# EAGLE design rpi_vga (EAGLE 6.6.0)
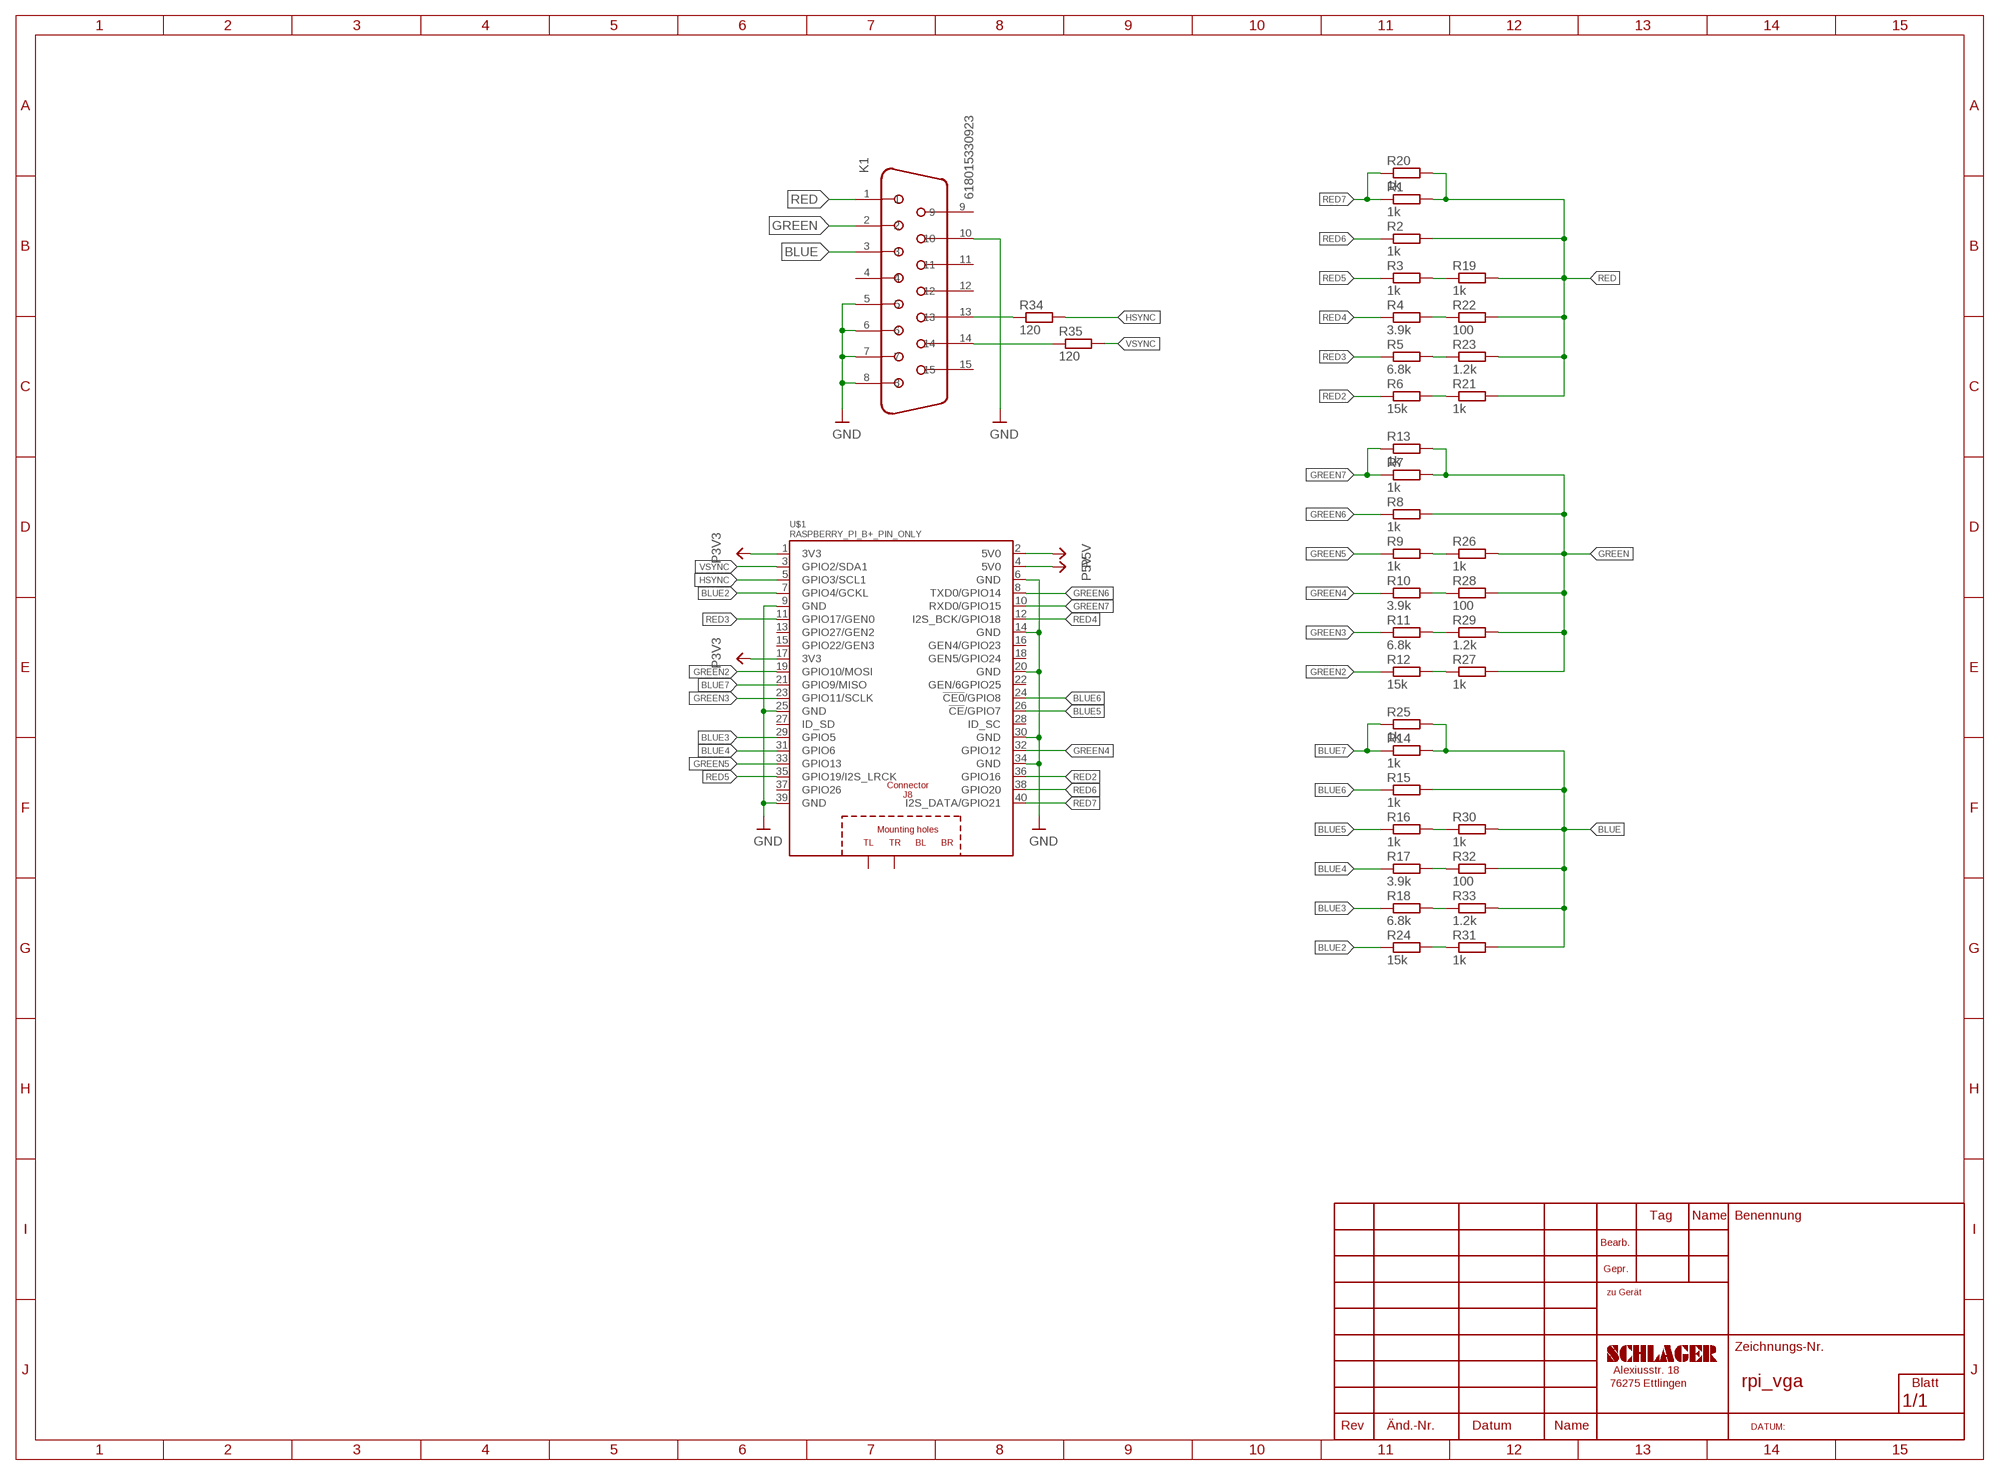
[diagram p0: schematic, sheet 1]

## Parts
K1  618015330923  [618015330923]
R1  1k  R-EU_R0603  [R0603]
R2  1k  R-EU_R0603  [R0603]
R3  1k  R-EU_R0603  [R0603]
R4  3.9k  R-EU_R0603  [R0603]
R5  6.8k  R-EU_R0603  [R0603]
R6  15k  R-EU_R0603  [R0603]
R7  1k  R-EU_R0603  [R0603]
R8  1k  R-EU_R0603  [R0603]
R9  1k  R-EU_R0603  [R0603]
R10  3.9k  R-EU_R0603  [R0603]
R11  6.8k  R-EU_R0603  [R0603]
R12  15k  R-EU_R0603  [R0603]
R13  1k  R-EU_R0603  [R0603]
R14  1k  R-EU_R0603  [R0603]
R15  1k  R-EU_R0603  [R0603]
R16  1k  R-EU_R0603  [R0603]
R17  3.9k  R-EU_R0603  [R0603]
R18  6.8k  R-EU_R0603  [R0603]
R19  1k  R-EU_R0603  [R0603]
R20  1k  R-EU_R0603  [R0603]
R21  1k  R-EU_R0603  [R0603]
R22  100  R-EU_R0603  [R0603]
R23  1.2k  R-EU_R0603  [R0603]
R24  15k  R-EU_R0603  [R0603]
R25  1k  R-EU_R0603  [R0603]
R26  1k  R-EU_R0603  [R0603]
R27  1k  R-EU_R0603  [R0603]
R28  100  R-EU_R0603  [R0603]
R29  1.2k  R-EU_R0603  [R0603]
R30  1k  R-EU_R0603  [R0603]
R31  1k  R-EU_R0603  [R0603]
R32  100  R-EU_R0603  [R0603]
R33  1.2k  R-EU_R0603  [R0603]
R34  120  R-EU_R0603  [R0603]
R35  120  R-EU_R0603  [R0603]
U$1  RASPBERRY_PI_B+_PIN_ONLY  [RASPBERRY_PI_B+_PIN_ONLY]

## Nets
BLUE: K1.3 R14.2 R15.2 R25.2 R30.2 R31.2 R32.2 R33.2
BLUE2: R24.1 U$1.7(GPIO4/GCKL)
BLUE3: R18.1 U$1.29(GPIO5)
BLUE4: R17.1 U$1.31(GPIO6)
BLUE5: R16.1 U$1.26(!CE!/GPIO7)
BLUE6: R15.1 U$1.24(!CE0!/GPIO8)
BLUE7: R14.1 R25.1 U$1.21(GPIO9/MISO)
GND: K1.5 K1.6 K1.7 K1.8 K1.10 U$1.6(GND) U$1.9(GND) U$1.14(GND) U$1.20(GND) U$1.25(GND) U$1.30(GND) U$1.34(GND) U$1.39(GND)
GREEN: K1.2 R7.2 R8.2 R13.2 R26.2 R27.2 R28.2 R29.2
GREEN2: R12.1 U$1.19(GPIO10/MOSI)
GREEN3: R11.1 U$1.23(GPIO11/SCLK)
GREEN4: R10.1 U$1.32(GPIO12)
GREEN5: R9.1 U$1.33(GPIO13)
GREEN6: R8.1 U$1.8(TXD0/GPIO14)
GREEN7: R7.1 R13.1 U$1.10(RXD0/GPIO15)
HSYNC: R34.2 U$1.5(GPIO3/SCL1)
N$1: R3.2 R19.1
N$2: R6.2 R21.1
N$3: R4.2 R22.1
N$4: R5.2 R23.1
N$5: R12.2 R27.1
N$6: R11.2 R29.1
N$7: R10.2 R28.1
N$8: R9.2 R26.1
N$9: R24.2 R31.1
N$10: R18.2 R33.1
N$11: R17.2 R32.1
N$12: R16.2 R30.1
N$13: K1.13 R34.1
N$14: K1.14 R35.1
P3V3: U$1.1(3V3) U$1.17(3V3)
P5V: U$1.2(5V0) U$1.4(5V0)
RED: K1.1 R1.2 R2.2 R19.2 R20.2 R21.2 R22.2 R23.2
RED2: R6.1 U$1.36(GPIO16)
RED3: R5.1 U$1.11(GPIO17/GEN0)
RED4: R4.1 U$1.12(I2S_BCK/GPIO18)
RED5: R3.1 U$1.35(GPIO19/I2S_LRCK)
RED6: R2.1 U$1.38(GPIO20)
RED7: R1.1 R20.1 U$1.40(I2S_DATA/GPIO21)
VSYNC: R35.2 U$1.3(GPIO2/SDA1)
Unconnected: K1.4 K1.9 K1.11 K1.12 K1.15 U$1.13(GPIO27/GEN2) U$1.15(GPIO22/GEN3) U$1.16(GEN4/GPIO23) U$1.18(GEN5/GPIO24) U$1.22(GEN/6GPIO25) U$1.27(ID_SD) U$1.28(ID_SC) U$1.37(GPIO26) U$1.PE_TL(TL) U$1.PE_TR(TR)

## Library data of the parts
K1 = Wuerth_Elektronik_eiCan_Communication_Connectors:618015330923: WR-DSUB Female High Density Angled PCB Connector with Hex Screw, 15 Pins
R1-R35 = debauer_passiv:R-EU_: RESISTOR, European symbol
U$1 = debauer_modules:RASPBERRY_PI_B+_PIN_ONLY

## Net classes
4 USBpair: width 0.254 mm, drill 0.406 mm, clearance 0.508 mm

## Board
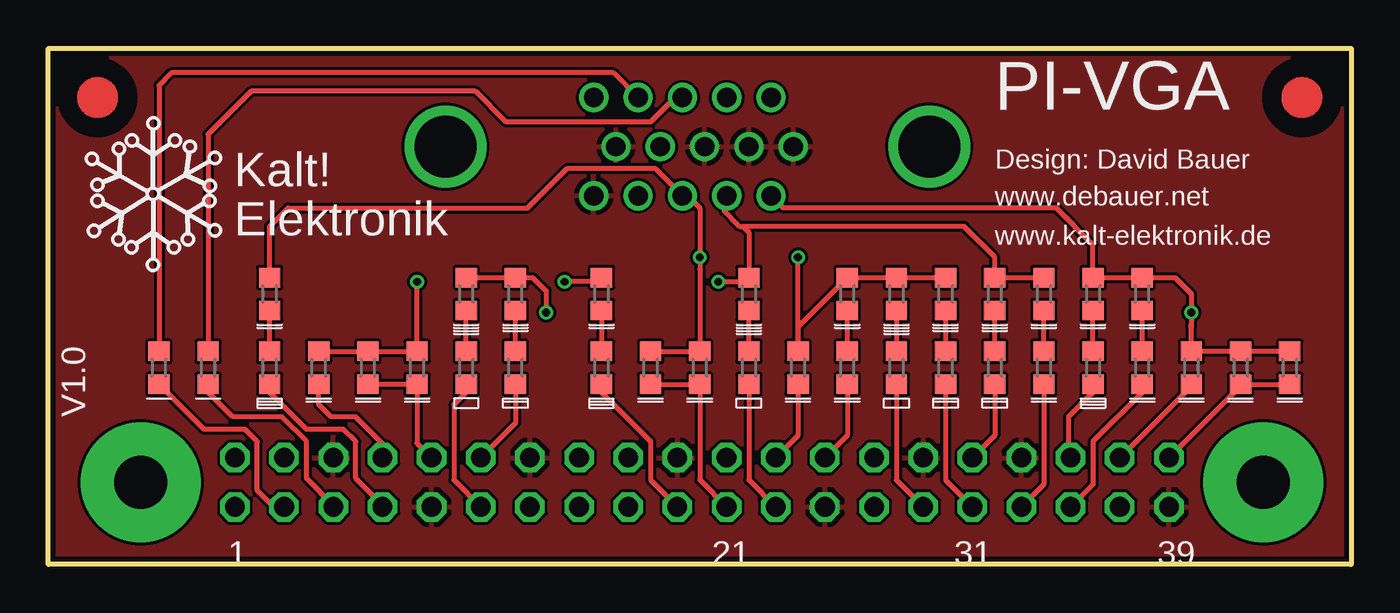
[diagram p1: board, top side]
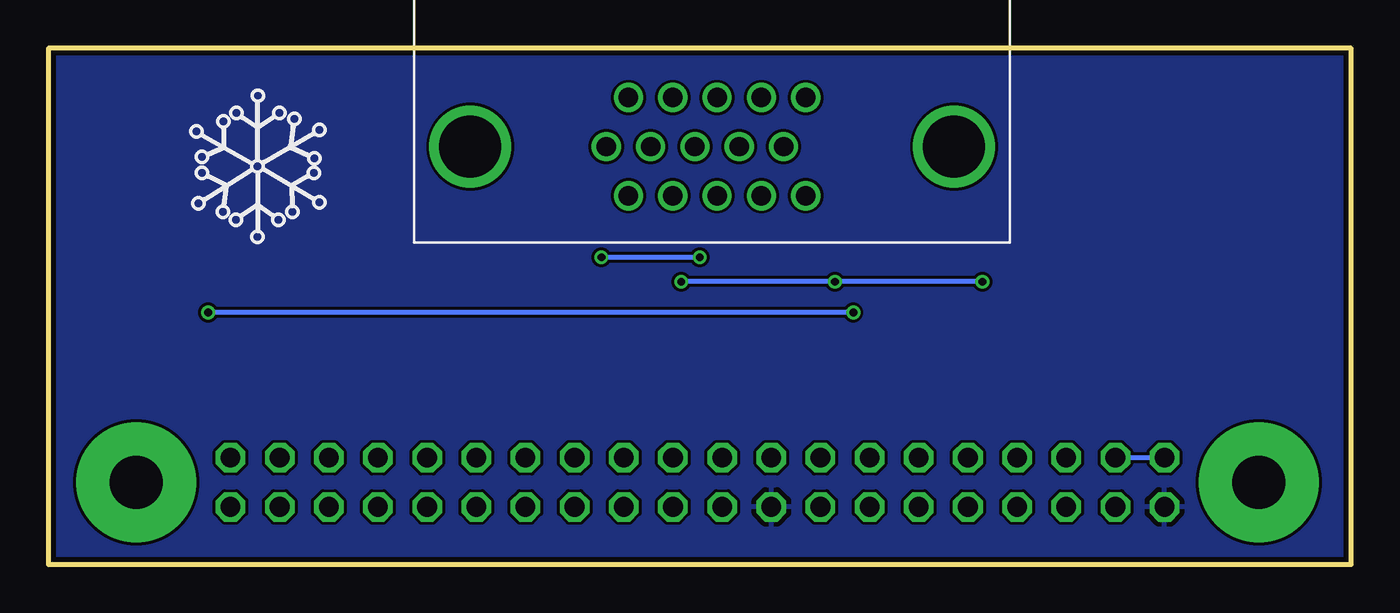
[diagram p2: board, bottom side, seen from below]

Size 67.31 x 26.67 mm. Coordinates in mm from the lower left corner, seen from the top.
Outline: 0,0 0,26.67 67.31,26.67 67.31,0 0,0
Copper layers (1*16): Top 0.035mm / dielectric 1.5mm / Bottom 0.035mm
Design rules "ITEADstudio_DRC": minimum track width 6mil, minimum drill 12mil, track to track 6mil, track to pad 6mil, pad to pad 6mil, via to via 6mil, smd to smd 0mil, copper to edge 10mil, drill to drill 10mil, minimum pad ring 10mil, minimum via ring 6mil, stop-mask expansion 2mil, vias tented up to drill 100mil, thermal gap 10mil

### Footprints (pad centres in the part's own frame; a part is rotated, then mirrored left to right if it is on the bottom)
618015330923 = drill 1: 1 4.32,2.54; 2 2.03,2.54; 3 -0.26,2.54; 4 -2.55,2.54; 5 -4.84,2.54; 6 5.465,0; 7 3.175,0; 8 0.885,0; 9 -1.405,0; 10 -3.695,0; 11 4.32,-2.54; 12 2.03,-2.54; 13 -0.26,-2.54; 14 -2.55,-2.54; 15 -4.84,-2.54 | drill 3.2: Z1 -12.5,0; Z2 12.5,0
R0603 = smd 1 x 1.1: 1 -0.85,0; 2 0.85,0
RASPBERRY_PI_B+_PIN_ONLY = drill 1.016 octagon: 1 8.37,1.7; 2 8.37,4.24; 3 10.91,1.7; 4 10.91,4.24; 5 13.45,1.7; 6 13.45,4.24; 7 15.99,1.7; 8 15.99,4.24; 9 18.53,1.7; 10 18.53,4.24; 11 21.07,1.7; 12 21.07,4.24; 13 23.61,1.7; 14 23.61,4.24; 15 26.15,1.7; 16 26.15,4.24; 17 28.69,1.7; 18 28.69,4.24; 19 31.23,1.7; 20 31.23,4.24; 21 33.77,1.7; 22 33.77,4.24; 23 36.31,1.7; 24 36.31,4.24; 25 38.85,1.7; 26 38.85,4.24; 27 41.39,1.7; 28 41.39,4.24; 29 43.93,1.7; 30 43.93,4.24; 31 46.47,1.7; 32 46.47,4.24; 33 49.01,1.7; 34 49.01,4.24; 35 51.55,1.7; 36 51.55,4.24; 37 54.09,1.7; 38 54.09,4.24; 39 56.63,1.7; 40 56.63,4.24 | drill 2.75 pad 6.2: PE_TL 3.5,2.97; PE_TR 61.5,2.97

### Placement (x,y rotation side)
K1  33.02,21.59 180 bottom
R1  61.59,10.16 90 top
R2  59.05,10.16 90 top
R3  56.52,10.16 90 top
R4  24.13,10.16 90 top
R5  21.59,10.16 90 top
R6  53.98,10.16 90 top
R7  19.05,10.16 90 top
R8  13.97,10.16 90 top
R9  51.44,10.16 90 top
R10  48.9,10.16 90 top
R11  36.2,10.16 90 top
R12  28.57,10.16 90 top
R13  16.51,10.16 90 top
R14  33.66,10.16 90 top
R15  38.73,10.16 90 top
R16  41.27,10.16 90 top
R17  46.35,10.16 90 top
R18  43.81,10.16 90 top
R19  56.52,13.97 90 top
R20  64.14,10.16 90 top
R21  53.98,13.97 90 top
R22  24.13,13.97 90 top
R23  21.59,13.97 90 top
R24  11.43,10.16 90 top
R25  31.11,10.16 90 top
R26  51.44,13.97 90 top
R27  28.57,13.97 90 top
R28  48.9,13.97 90 top
R29  36.2,13.97 90 top
R30  41.27,13.97 90 top
R31  11.43,13.97 90 top
R32  46.35,13.97 90 top
R33  43.81,13.97 90 top
R34  8.26,10.16 270 top
R35  5.71,10.16 270 top
U$1  1.27,1.27 0 top
U$2  [KALT!ELEKTRONIK]  12.7,19.05 0 top
U$3  [PASSMARK]  2.54,24.13 0 top
U$4  [PASSMARK]  64.77,24.13 0 top
U$5  [SNOW]  56.52,20.95 0 bottom

### Tracks (layer width: path | path; a pad name or v marks a point on that pad's centre or on a via)
BLUE  (via drill 0.4)
  Top 0.254: R25.2 R14.2 33.66,15.24 v33.66,15.88 33.66,18.41 33.02,19.05 K1.3 31.33,20.48 26.83,20.48 24.77,18.41 12.38,18.41 11.43,17.46 R31.2 11.43,16.51 | R32.2 R33.2 R30.2 38.73,12.28 R15.2 v38.73,15.88
  Bottom 0.254: v38.73,15.88 v33.66,15.88
BLUE2
  Top 0.254: U$1.7 17.26,3.06 15.88,4.45 15.88,6.35 15.24,6.99 13.34,6.99 11.43,8.89 R24.1
BLUE3
  Top 0.254: R18.1 43.81,4.36 U$1.29
BLUE4
  Top 0.254: R17.1 46.35,4.36 U$1.31
BLUE5
  Top 0.254: R16.1 41.27,6.67 U$1.26
BLUE6
  Top 0.254: R15.1 38.73,6.67 U$1.24
BLUE7
  Top 0.254: U$1.21 33.66,4.36 R14.1 R25.1
GND
  pour Top: -3.81,60.96 95.25,60.96 95.25,-3.81 -3.81,-3.81
GREEN  (via drill 0.4)
  Top 0.254: R8.2 R13.2 R7.2 v19.05,14.61 | R26.2 R28.2 48.9,15.88 47.31,17.46 35.88,17.46 | K1.2 34.92,18.93 34.92,18.26 35.72,17.46 35.88,17.46 | 35.88,17.46 36.2,17.14 R29.2 35.98,14.61 v34.61,14.61 | 28.26,14.61 28.36,14.61 R27.2 28.47,14.82 28.26,14.61 | 28.26,14.61 v26.67,14.61
  Bottom 0.254: v19.05,14.61 v26.67,14.61 v34.61,14.61
GREEN2
  Top 0.254: R12.1 28.57,8.89 31.11,6.35 31.11,4.36 U$1.19
GREEN3
  Top 0.254: R11.1 36.2,4.36 U$1.23
GREEN4
  Top 0.254: R10.1 48.9,6.67 U$1.32
GREEN5
  Top 0.254: R9.1 51.44,4.12 U$1.33
GREEN6
  Top 0.254: U$1.8 17.26,6.24 15.88,7.62 14.61,7.62 13.97,8.26 R8.1
GREEN7
  Top 0.254: R13.1 R7.1 19.05,6.26 U$1.10
HSYNC
  Top 0.254: U$1.5 14.72,3.06 13.34,4.45 13.34,6.35 12.06,7.62 9.53,7.62 8.26,8.89 R34.2
N$1
  Top 0.254: R3.2 R19.1
N$2
  Top 0.254: R6.2 R21.1
N$3
  Top 0.254: R4.2 R22.1
N$4
  Top 0.254: R5.2 R23.1
N$5
  Top 0.254: R27.1 R12.2
N$6
  Top 0.254: R11.2 R29.1
N$7
  Top 0.254: R10.2 R28.1
N$8
  Top 0.254: R9.2 R26.1
N$9
  Top 0.254: R24.2 R31.1
N$10
  Top 0.254: R33.1 R18.2
N$11
  Top 0.254: R32.1 R17.2
N$12
  Top 0.254: R16.2 R30.1
N$13
  Top 0.254: K1.13 32.38,24.13 31.11,22.86 23.65,22.86 22.07,24.45 10.48,24.45 8.26,22.23 R34.1
N$14
  Top 0.254: R35.1 5.71,24.77 6.35,25.4 29.2,25.4 K1.14
P3V3
  pour Bottom: -8.89,64.77 102.87,64.77 102.87,-10.16 -8.89,-10.16
P5V
  Bottom 0.254: U$1.2 U$1.4
RED  (via drill 0.4)
  Top 0.254: R20.2 R1.2 R2.2 59.05,12.28 59,12.33 59.05,12.38 v59.05,13.02 59.05,13.97 58.2,14.82 R19.2 R21.2 53.98,16.51 52.07,18.41 37.98,18.41 K1.1 | R23.2 R22.2 25.03,14.82 25.72,14.13 v25.72,13.02
  Bottom 0.254: v25.72,13.02 v59.05,13.02
RED2
  Top 0.254: R6.1 53.98,8.89 52.7,7.62 52.7,5.62 U$1.36
RED3
  Top 0.254: R5.1 21.59,8.89 20.95,8.26 20.95,4.36 U$1.11
RED4
  Top 0.254: R4.1 24.13,7.3 U$1.12
RED5
  Top 0.254: R3.1 56.52,8.89 53.98,6.35 53.98,4.12 U$1.35
RED6
  Top 0.254: R2.1 59.05,9.21 U$1.38
RED7
  Top 0.254: U$1.40 61.59,9.21 R1.1 R20.1
VSYNC
  Top 0.254: U$1.3 11.63,2.97 10.79,3.81 10.79,6.35 10.16,6.99 8.04,6.99 R35.2

### Text on the board
tPlace: PI-VGA | Design: David Bauer | www.debauer.net | www.kalt-elektronik.de | V1.0